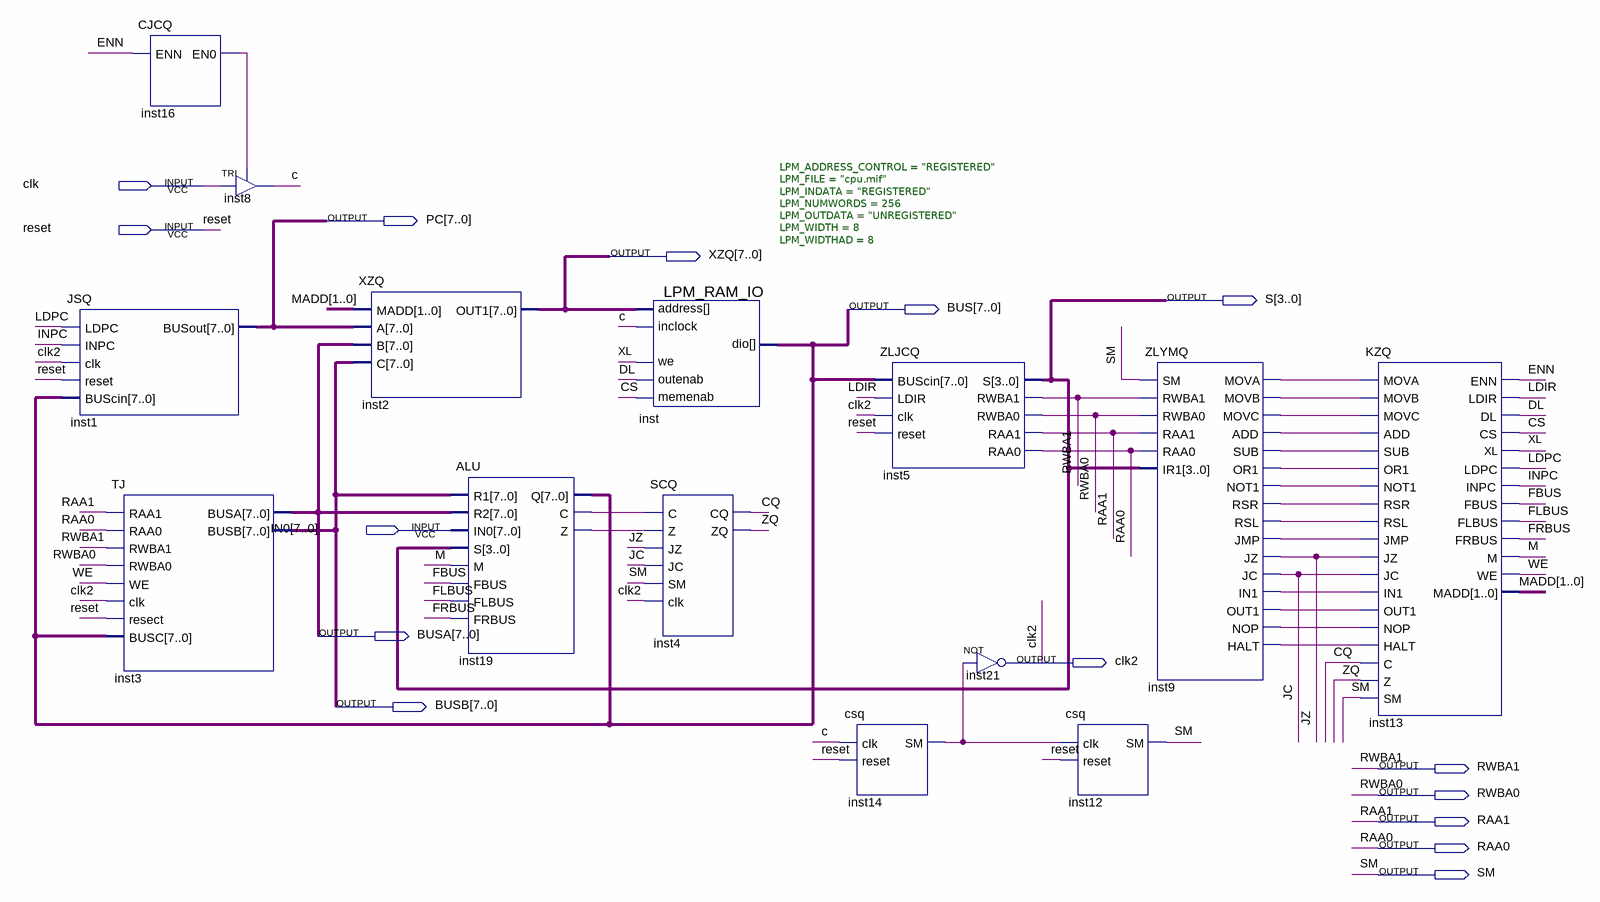
[diagram p0: schematic sheet]
// Quartus schematic cpu.bdf as structural Verilog: 14 symbols, 15 pins
module cpu (
  input  clk,
  input  reset,
  input  [7:0] IN0,
  output [7:0] PC,
  output [7:0] XZQ,
  output [3:0] S,
  output [7:0] BUS,
  output [7:0] BUSA,
  output clk2,
  output [7:0] BUSB,
  output RWBA1,
  output RWBA0,
  output RAA1,
  output RAA0,
  output SM
);

  wire c, CQ, CS, DL, ENN, FBUS, FLBUS, FRBUS, INPC, inst9_add, inst9_halt, inst9_in1, inst9_jmp, inst9_mova,
       inst9_movb, inst9_movc, inst9_nop, inst9_not1, inst9_or1, inst9_out1, inst9_rsl, inst9_rsr, inst9_sub,
       inst14_sm, inst16_en0, inst19_c, inst19_z, JC, JZ, LDIR, LDPC, M, WE, XL, ZQ;
  wire [1:0] MADD;

  JSQ inst1 (.LDPC(LDPC), .INPC(INPC), .clk(clk2), .reset(reset), .BUScin(BUS), .BUSout(PC));
  CJCQ inst16 (.ENN(ENN), .EN0(inst16_en0));
  TJ inst3 (
    .RAA1(RAA1), .RAA0(RAA0), .RWBA1(RWBA1), .RWBA0(RWBA0), .WE(WE), .clk(clk2), .resect(reset), .BUSC(BUS),
    .BUSA(BUSA), .BUSB(BUSB));
  TRI inst8 (.IN(clk), .OE(inst16_en0), .OUT(c));
  XZQ inst2 (.MADD(MADD), .A(PC), .B(BUSA), .C(BUSB), .OUT1(XZQ));
  ALU inst19 (
    .R1(BUSB), .R2(BUSA), .IN0(IN0), .S(S), .M(M), .FBUS(FBUS), .FLBUS(FLBUS), .FRBUS(FRBUS), .Q(BUS),
    .C(inst19_c), .Z(inst19_z));
  LPM_RAM_IO #(.LPM_ADDRESS_CONTROL("REGISTERED"), .LPM_FILE("cpu.mif"), .LPM_INDATA("REGISTERED"), .LPM_NUMWORDS(256), .LPM_OUTDATA("UNREGISTERED"), .LPM_WIDTH(8), .LPM_WIDTHAD(8)) inst (
    .address(XZQ), .memenab(CS), .inclock(c), .we(XL), .outenab(DL), .dio(BUS));
  SCQ inst4 (.C(inst19_c), .Z(inst19_z), .JZ(JZ), .JC(JC), .SM(SM), .clk(clk2), .CQ(CQ), .ZQ(ZQ));
  csq inst14 (.clk(c), .reset(reset), .SM(inst14_sm));
  ZLJCQ inst5 (
    .BUScin(BUS), .LDIR(LDIR), .clk(clk2), .reset(reset), .S(S), .RWBA1(RWBA1), .RWBA0(RWBA0), .RAA1(RAA1),
    .RAA0(RAA0));
  not inst21 (clk2, inst14_sm);
  csq inst12 (.clk(inst14_sm), .reset(reset), .SM(SM));
  ZLYMQ inst9 (
    .SM(SM), .RWBA1(RWBA1), .RWBA0(RWBA0), .RAA1(RAA1), .RAA0(RAA0), .IR1(S), .MOVA(inst9_mova),
    .MOVB(inst9_movb), .MOVC(inst9_movc), .ADD(inst9_add), .SUB(inst9_sub), .OR1(inst9_or1),
    .NOT1(inst9_not1), .RSR(inst9_rsr), .RSL(inst9_rsl), .JMP(inst9_jmp), .JZ(JZ), .JC(JC), .IN1(inst9_in1),
    .OUT1(inst9_out1), .NOP(inst9_nop), .HALT(inst9_halt));
  KZQ inst13 (
    .MOVA(inst9_mova), .MOVB(inst9_movb), .MOVC(inst9_movc), .ADD(inst9_add), .SUB(inst9_sub),
    .OR1(inst9_or1), .NOT1(inst9_not1), .RSR(inst9_rsr), .RSL(inst9_rsl), .JMP(inst9_jmp), .JZ(JZ), .JC(JC),
    .IN1(inst9_in1), .OUT1(inst9_out1), .NOP(inst9_nop), .HALT(inst9_halt), .C(CQ), .Z(ZQ), .SM(SM),
    .ENN(ENN), .LDIR(LDIR), .DL(DL), .CS(CS), .XL(XL), .LDPC(LDPC), .INPC(INPC), .FBUS(FBUS), .FLBUS(FLBUS),
    .FRBUS(FRBUS), .M(M), .WE(WE), .MADD(MADD));
endmodule
